# Altium schematic sheet Sheet1.SchDoc
size A4
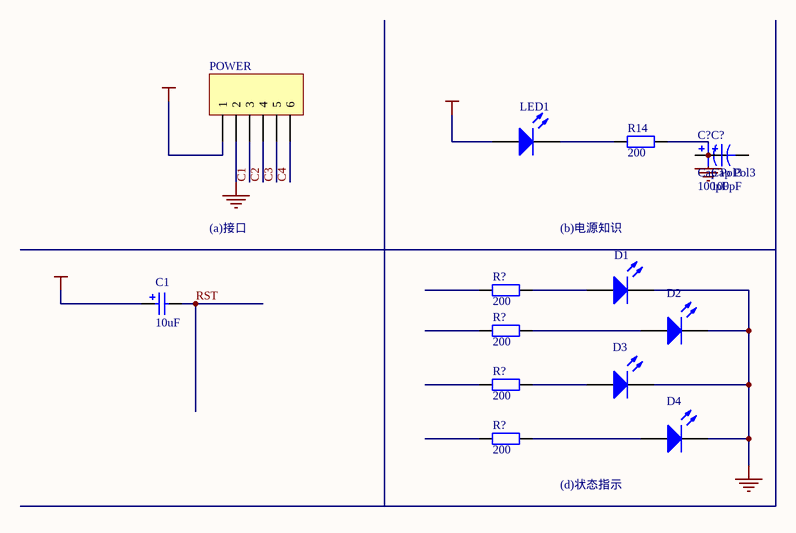
[diagram p0: Sheet1.SchDoc]

## Parts
(Parts that share a designator on the sheet are numbered #1, #2 ... from top to bottom, then left to right.)
C1  value 10uF  [POLAR0.8]  (hidden comment: Cap Pol2)
C?#1  Cap Pol3  value 100pF  [CC2012-0805]
C?#2  Cap Pol3  value 100pF  [CC2012-0805]
D1  LED0  [LED-0]  (value not drawn)
D2  LED0  [LED-0]  (value not drawn)
D3  (no value)  [LED-0]
D4  (no value)  [LED-0]
LED1  LED0  [LED-0]  (value not drawn)
POWER  Header 6  [HDR1X6]  (value not drawn)
R14  200  [AXIAL-0.4]
R?#1  200  [AXIAL-0.4]
R?#2  200  [AXIAL-0.4]
R?#3  200  [AXIAL-0.4]
R?#4  200  [AXIAL-0.4]

## Nets
GND: C?#2.1 D1.2(K) D2.2(K) D3.2(K) D4.2(K) POWER.2 R14.2
VCC: C1.1 LED1.1(A) POWER.1
C1: POWER.3
C2: POWER.4
C3: POWER.5
C4: POWER.6
RST: C1.2
NetD1_1: D1.1(A) R?#1.2
NetD2_1: D2.1(A) R?#2.2
NetD3_1: D3.1(A) R?#3.2
NetD4_1: D4.1(A) R?#4.2
NetLED1_2: LED1.2(K) R14.1

Not connected (* = marked no-connect by the designer): C?#1 1 2; C?#2 2; R?#1 1; R?#2 1; R?#3 1; R?#4 1

## Notes on the sheet
- (a)接口
- (b)电源知识
- (d)状态指示

## Library data of the parts
C1 = Cap Pol2: Polarized Capacitor (Axial); Published: 8-Jun-2000; LatestRevisionDate: 17-Jul-2002; LatestRevisionNote: Re-released for DXP Platform.; Publisher: Altium Limited
C?#1 C?#2 = Cap Pol3: Polarized Capacitor (Surface Mount); Published: 8-Jun-2000; LatestRevisionDate: 17-Jul-2002; LatestRevisionNote: Re-released for DXP Platform.; PackageReference: C0805; Publisher: Altium Limited
D1-D4 LED1 = LED0: Typical INFRARED GaAs LED; Published: 8-Jun-2000; LatestRevisionDate: 17-Jul-2002; LatestRevisionNote: Re-released for DXP Platform.; Publisher: Altium Limited
POWER = Header 6: Header, 6-Pin; LatestRevisionDate: 17-Jul-2002; LatestRevisionNote: Re-released for DXP Platform.; Publisher: Altium Limited
R14 R?#1-R?#3 = Res2: Resistor; Value: 1K; Published: 8-Jun-2000; LatestRevisionDate: 17-Jul-2002; LatestRevisionNote: Re-released for DXP Platform.; Publisher: Altium Limited
R?#4 = Res2: Resistor; Value: 0; Published: 8-Jun-2000; LatestRevisionDate: 17-Jul-2002; LatestRevisionNote: Re-released for DXP Platform.; Publisher: Altium Limited